# Altium schematic sheet led.SchDoc
size A4; SheetNumber: 1; SheetTotal: 8
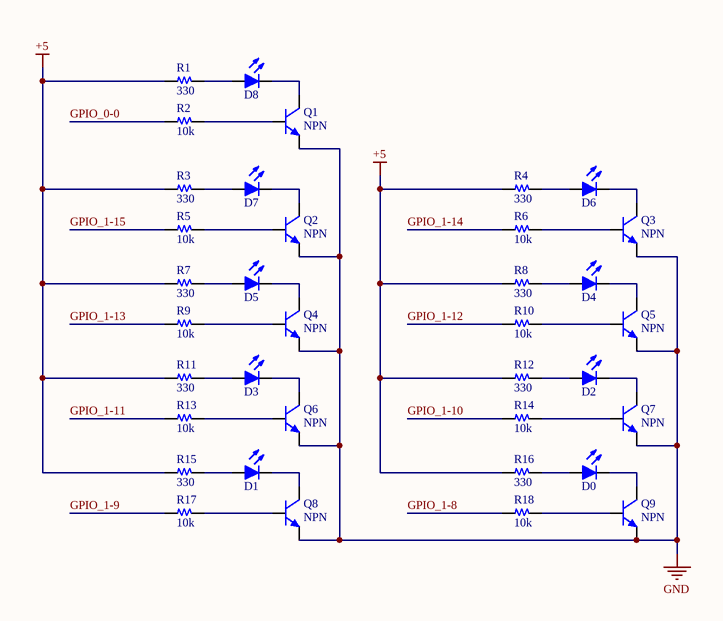
[diagram p0: led.SchDoc]

## Parts
D0  Led  [Led 0805]  (value not drawn)
D1  Led  [Led 0805]  (value not drawn)
D2  Led  [Led 0805]  (value not drawn)
D3  Led  [Led 0805]  (value not drawn)
D4  Led  [Led 0805]  (value not drawn)
D5  Led  [Led 0805]  (value not drawn)
D6  Led  [Led 0805]  (value not drawn)
D7  Led  [Led 0805]  (value not drawn)
D8  Led  [Led 0805 RED]  (value not drawn)
Q1  NPN  [SOT-23]
Q2  NPN  [SOT-23]
Q3  NPN  [SOT-23]
Q4  NPN  [SOT-23]
Q5  NPN  [SOT-23]
Q6  NPN  [SOT-23]
Q7  NPN  [SOT-23]
Q8  NPN  [SOT-23]
Q9  NPN  [SOT-23]
R1  330  [R 0603]
R2  10k  [R 0603]
R3  330  [R 0603]
R4  330  [R 0603]
R5  10k  [R 0603]
R6  10k  [R 0603]
R7  330  [R 0603]
R8  330  [R 0603]
R9  10k  [R 0603]
R10  10k  [R 0603]
R11  330  [R 0603]
R12  330  [R 0603]
R13  10k  [R 0603]
R14  10k  [R 0603]
R15  330  [R 0603]
R16  330  [R 0603]
R17  10k  [R 0603]
R18  10k  [R 0603]

## Nets
+5: R1.1 R3.1 R4.1 R7.1 R8.1 R11.1 R12.1 R15.1 R16.1
GND: Q1.2(E) Q2.2(E) Q3.2(E) Q4.2(E) Q5.2(E) Q6.2(E) Q7.2(E) Q8.2(E) Q9.2(E)
GPIO_0-0: R2.1
GPIO_1-8: R18.1
GPIO_1-9: R17.1
GPIO_1-10: R14.1
GPIO_1-11: R13.1
GPIO_1-12: R10.1
GPIO_1-13: R9.1
GPIO_1-14: R6.1
GPIO_1-15: R5.1
NetD0_1: D0.1(A) R16.2
NetD0_2: D0.2(K) Q9.3(C)
NetD1_1: D1.1(A) R15.2
NetD1_2: D1.2(K) Q8.3(C)
NetD2_1: D2.1(A) R12.2
NetD2_2: D2.2(K) Q7.3(C)
NetD3_1: D3.1(A) R11.2
NetD3_2: D3.2(K) Q6.3(C)
NetD4_1: D4.1(A) R8.2
NetD4_2: D4.2(K) Q5.3(C)
NetD5_1: D5.1(A) R7.2
NetD5_2: D5.2(K) Q4.3(C)
NetD6_1: D6.1(A) R4.2
NetD6_2: D6.2(K) Q3.3(C)
NetD7_1: D7.1(A) R3.2
NetD7_2: D7.2(K) Q2.3(C)
NetD8_1: D8.1(A) R1.2
NetD8_2: D8.2(K) Q1.3(C)
NetQ1_1: Q1.1(B) R2.2
NetQ2_1: Q2.1(B) R5.2
NetQ3_1: Q3.1(B) R6.2
NetQ4_1: Q4.1(B) R9.2
NetQ5_1: Q5.1(B) R10.2
NetQ6_1: Q6.1(B) R13.2
NetQ7_1: Q7.1(B) R14.2
NetQ8_1: Q8.1(B) R17.2
NetQ9_1: Q9.1(B) R18.2

## Library data of the parts
D0-D8 = Led: Typical LED
Q1-Q9 = Transistor NPN: NPN Bipolar Transistor
R1-R18 = Resistor